# EAGLE design Raspberry_output_for_PWM_based_Fan_driver_with_jumper_cables (EAGLE 7.5.0)
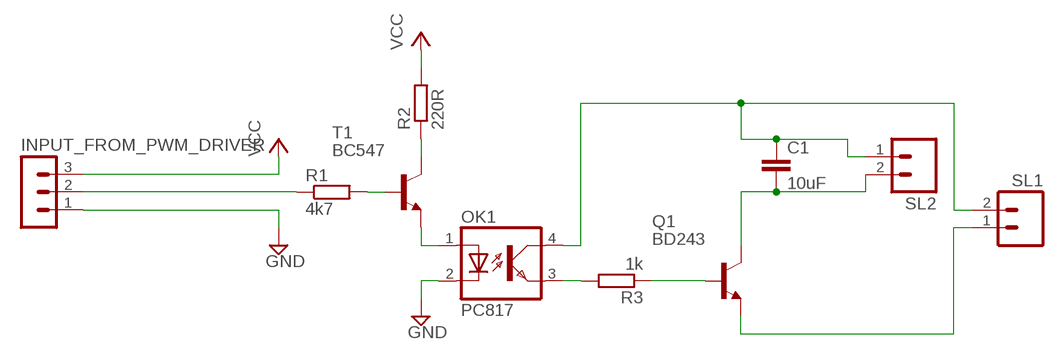
[diagram p0: schematic, sheet 1]

## Parts
C1  10uF  C2.5/5  [C2.5-5]
INPUT_FROM_PWM_DRIVER  MA03-1  [MA03-1]
OK1  PC817  [DIL04]
Q1  BD243  [TO220]
R1  4k7  R-EU_0207/10  [0207/10]
R2  220R  R-EU_0207/10  [0207/10]
R3  1k  R-EU_0207/10  [0207/10]
SL1  MA02  [02PA]
SL2  MA02  [02PA]
T1  BC547  [TO92]

## Nets
GND: INPUT_FROM_PWM_DRIVER.1 OK1.2(C)
INPUT: INPUT_FROM_PWM_DRIVER.2 R1.1
INPUT_REGULATED_CURR_2_BASE: R1.2 T1.2(B)
N$2: R2.1 T1.3(C)
OPTO_IN: OK1.1(A) T1.1(E)
OPTO_OUT_2_TR: OK1.3(EMIT) R3.2
OUTPUT_N: C1.2 Q1.2(C) SL2.2
SOURCE_N_0V: Q1.3(E) SL1.1
SOURCE_P_12V: C1.1 OK1.4(COL) SL1.2 SL2.1
TR_OUTPUT_BASE: Q1.1(B) R3.1
VCC: INPUT_FROM_PWM_DRIVER.3 R2.2

## Library data of the parts
C1 = capacitor-wima:C: CAPACITOR naming: grid - package width
INPUT_FROM_PWM_DRIVER = con-lstb:MA03-1: PIN HEADER
OK1 = optocoupler:PC817: SHARP OPTO COUPLER
Q1 = transistor-npn:BD243*: NPN Transistor
R1-R3 = rcl:R-EU_: RESISTOR, European symbol
SL1 SL2 = con-amp-quick:MA02: AMP QUICK CONNECTOR; OC_FARNELL: unknown; OC_NEWARK: unknown
T1 = transistor-neu-to92:BC547: NPN TRANSISTOR

## Board
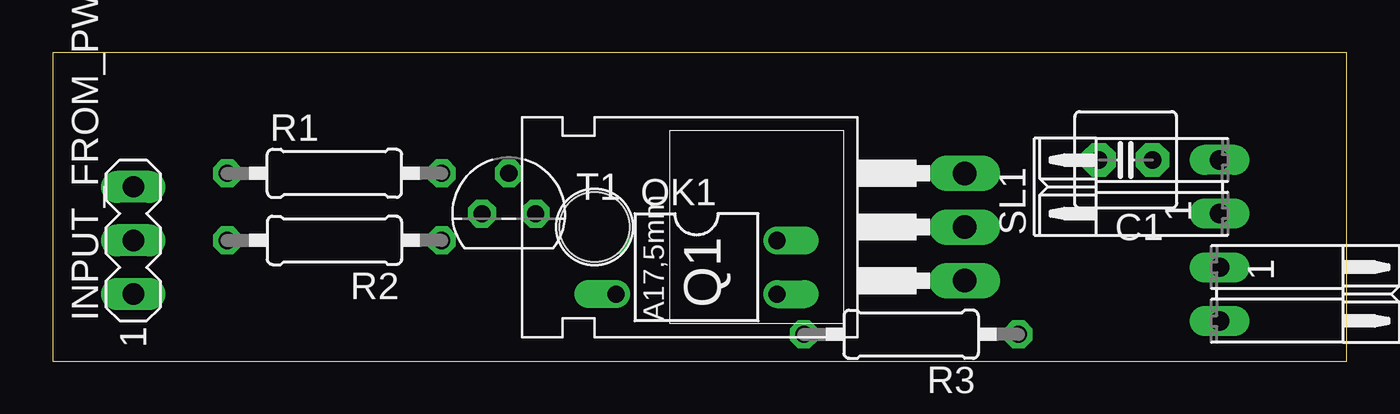
[diagram p1: board, top side]
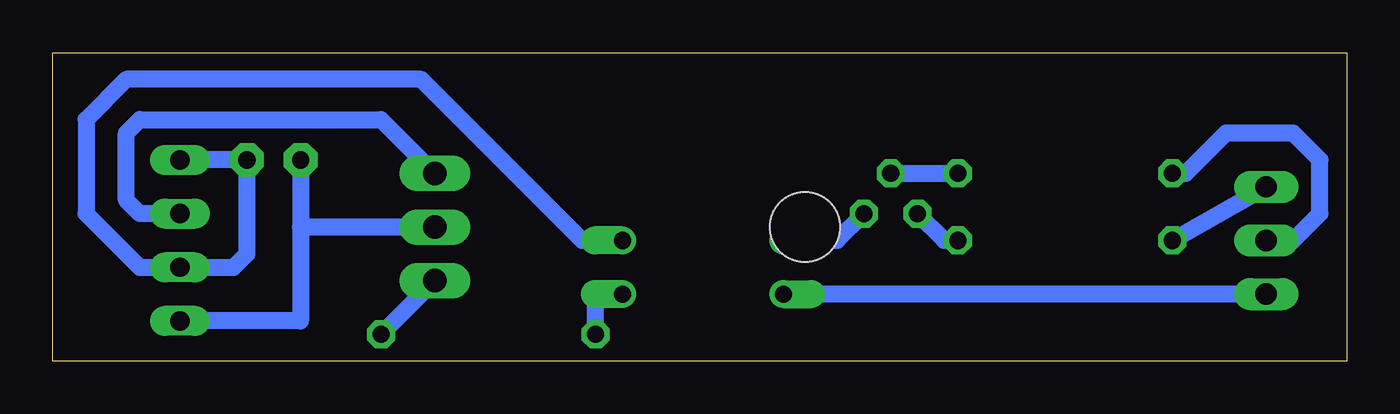
[diagram p2: board, bottom side, seen from below]

Size 61.27 x 14.6 mm. Coordinates in mm from the lower left corner, seen from the top.
Outline: 0,0 61.27,0 61.27,14.6 0,14.6 0,0
Copper layers (1*16): Top 0.035mm / dielectric 1.5mm / Bottom 0.035mm
Design rules "default": minimum track width 10mil, minimum drill 24mil, track to track 8mil, track to pad 8mil, pad to pad 8mil, via to via 8mil, smd to smd 8mil, copper to edge 40mil, drill to drill 8mil, minimum pad ring 10mil, minimum via ring 8mil, stop-mask expansion 4mil, vias tented up to drill 0mil, thermal gap 10mil

### Footprints (pad centres in the part's own frame; a part is rotated, then mirrored left to right if it is on the bottom)
C2.5-5 = drill 0.813 pad 1.6 octagon: 1 -1.27,0; 2 1.27,0
MA03-1 = drill 1.016 long: 1 -2.54,0; 2 0,0; 3 2.54,0
DIL04 = drill 0.813 offset: 1 -1.27,-3.81; 2 1.27,-3.81; 3 1.27,3.81; 4 -1.27,3.81
TO220 = drill 1.118 long: 1 -2.54,-6.35; 2 0,-6.35; 3 2.54,-6.35 | hole 3.302: 0,11.176
0207/10 = drill 0.813 octagon: 1 -5.08,0; 2 5.08,0
02PA = drill 0.914 long: 1 -1.27,0; 2 1.27,0
TO92 = drill 0.813 octagon: 1 1.27,0; 2 0,1.905; 3 -1.27,0

### Placement (x,y rotation side)
C1  50.8,9.53 180 top
INPUT_FROM_PWM_DRIVER  3.81,5.71 90 top
OK1  30.48,4.45 270 top
Q1  36.83,6.35 90 top
R1  13.34,8.89 0 top
R2  13.34,5.71 180 top
R3  40.64,1.27 180 top
SL1  55.24,8.26 90 top
SL2  55.24,3.17 270 top
T1  21.59,6.99 0 top

### Tracks (layer width: path | path; a pad name or v marks a point on that pad's centre or on a via)
GND
  Bottom 0.813: INPUT_FROM_PWM_DRIVER.1 OK1.2
INPUT
  Bottom 0.813: INPUT_FROM_PWM_DRIVER.2 2.54,5.71 1.27,6.99 1.27,9.53 2.54,10.79 5.71,10.79 7.62,8.89 R1.1
INPUT_REGULATED_CURR_2_BASE
  Bottom 0.813: T1.2 R1.2
N$2
  Bottom 0.813: R2.1 19.05,5.71 T1.3
OPTO_IN
  Bottom 0.813: OK1.1 24.13,5.71 T1.1
OPTO_OUT_2_TR
  Bottom 0.813: R3.2 35.56,3.17 OK1.3
OUTPUT_N
  Bottom 0.813: Q1.2 49.53,6.35 | 49.53,6.35 49.53,1.91 SL2.2 | C1.2 49.53,6.35
SOURCE_N_0V
  Bottom 0.813: SL1.1 57.15,6.99 57.78,7.62 57.78,10.79 57.15,11.43 45.72,11.43 Q1.3
SOURCE_P_12V
  Bottom 0.813: SL1.2 C1.1 52.07,5.08 52.7,4.45 SL2.1 57.15,4.45 59.69,6.99 59.69,11.43 57.78,13.34 43.81,13.34 36.2,5.71 OK1.4
TR_OUTPUT_BASE
  Bottom 0.813: R3.1 Q1.1
VCC
  Bottom 0.813: R2.2 INPUT_FROM_PWM_DRIVER.3